# Altium schematic sheet EIS_Flow_Main.SchDoc: 2D-Flow Main
size A4; Organization: Hahn-Schickard; Address1: Wilhelm-Schickard-Str. 10; Address2: 78052 Villingen-Schwenningen; Address3: Bernd.Ehrbrecht@Hahn-Schickard.de; DocumentNumber: 1; Revision: 1.0; SheetNumber: 1; SheetTotal: 2; PhoneNumber: 0 7721 943 137; E-Mail: Xxxx.Xxxx@Hahn-Schickard.de; PageSetup: Record=PageOptions|CenterHorizontal=True|CenterVertical=True|PrintScale=0.97|XCorrection=1.00|YCorrection=1.00|PrintKind=1|BorderSize=5000000|LeftOffset=0|BottomOffset=0|Orientation=2|PaperLength=1000|PaperWidth=1000|Scale=100|PaperSource=15|PrintQuality=600|MediaType=1|DitherType=10|PrintScaleMode=1|PaperKind=A4 (210 x 297 mm)|PaperIndex=9; ProjectName: Project File Name
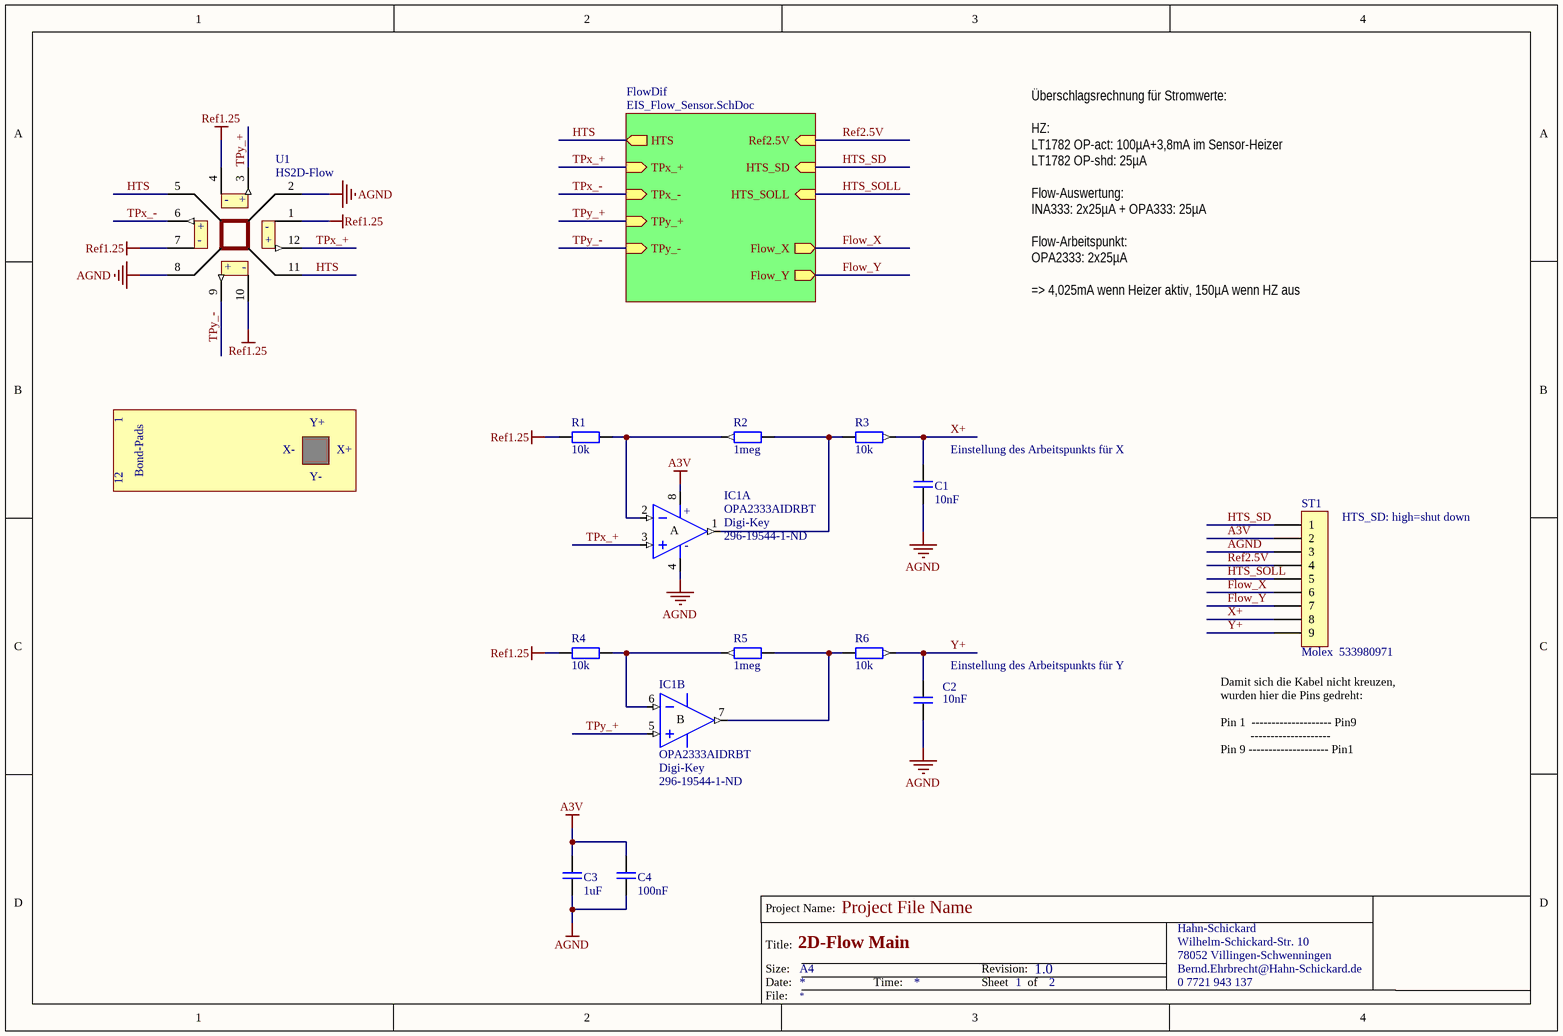
[diagram p0: EIS_Flow_Main.SchDoc]

## Parts
C1  10nF  [CAPC1608N]
C2  10nF  [CAPC1608N]
C3  1uF  [CAPC2012N]
C4  100nF  [CAPC1608N]
IC1  OPA2333AIDRBT  Supplier 1: Digi-Key  Supplier Part Number 1: 296-19544-1-ND  [TI DRB (S-PVON-N8)]  (parts A,B of 2)
R1  10k  [RESC1608N]
R2  1meg  [RESC1608N]
R3  10k  [RESC1608N]
R4  10k  [RESC1608N]
R5  1meg  [RESC1608N]
R6  10k  [RESC1608N]
ST1  Molex  533980971  [Picoblade 9*1,25V]
U1  HS2D-Flow  [Bond_Flow_12p]

## Sub-sheets
FlowDif = EIS_Flow_Sensor.SchDoc: HTS_SD (in), HTS_SOLL (in), Ref2.5V (in), HTS (out), Flow_X (out), TPx_+ (in), TPx_- (in), Flow_Y (out), TPy_+ (in), TPy_- (in)

## Nets
A3V: C3.1 C4.1 IC1.8(V+) ST1.2
AGND: C1.1 C2.2 C3.2 C4.2 IC1.4(V-) ST1.3 U1.2(HZ_nw) U1.8(HZ_so)
Ref1.25: R1.1 R4.1 U1.1(TPn-) U1.4(TPw-) U1.7(TPs-) U1.10(TPo-)
Flow_X: ST1.6 ; sheet FlowDif/Flow_X
Flow_Y: ST1.7 ; sheet FlowDif/Flow_Y
HTS: U1.5(HZ_sw) U1.11(HZ_no) ; sheet FlowDif/HTS
HTS_SD: ST1.1 ; sheet FlowDif/HTS_SD
HTS_SOLL: ST1.5 ; sheet FlowDif/HTS_SOLL
Ref2.5V: ST1.4 ; sheet FlowDif/Ref2.5V
TPx_+: IC1.3(IN1+) U1.12(TPn+) ; sheet FlowDif/TPx_+
TPx_-: U1.6(TPs+) ; sheet FlowDif/TPx_-
TPy_+: IC1.5(IN1+) U1.3(TPw+) ; sheet FlowDif/TPy_+
TPy_-: U1.9(TPo+) ; sheet FlowDif/TPy_-
X+: C1.2 R3.2 ST1.8
Y+: C2.1 R6.2 ST1.9
NetIC1_1: IC1.1(OUT1) R2.2 R3.1
NetIC1_2: IC1.2(IN1-) R1.2 R2.1
NetIC1_6: IC1.6(IN1-) R4.2 R5.1
NetIC1_7: IC1.7(OUT1) R5.2 R6.1

## Notes on the sheet
- Überschlagsrechnung für Stromwerte:
  HZ:
  LT1782 OP-act: 100µA+3,8mA im Sensor-Heizer
  LT1782 OP-shd: 25µA
  Flow-Auswertung:
  INA333: 2x25µA + OPA333: 25µA
  Flow-Arbeitspunkt:
  OPA2333: 2x25µA
  => 4,025mA wenn Heizer aktiv, 150µA wenn HZ aus
- 1
- Y+
- 12
- Bond-Pads
- X-
- Y-
- X+
- (near C1) Einstellung des Arbeitspunkts für X
- (near ST1) HTS_SD: high=shut down
- (near C2) Einstellung des Arbeitspunkts für Y
- (near ST1) Damit sich die Kabel nicht kreuzen, wurden hier die Pins gedreht:
  Pin 1  -------------------- Pin9
  --------------------
  Pin 9 -------------------- Pin1
- Project Name:
- Size:
- Date:
- Title:
- A4
- Time:
- Revision:
- Sheet
- of
- File:
- (in symbol HS2D-Flow) -; +
- (in symbol OPA2333AIDRBT, part A) +; A; -
- (in symbol OPA2333AIDRBT, part B) B

## Library data of the parts
C1-C4 = Kondensator SMD Keramik
IC1 = OPA2333AIDRBT: Dual micro Power OP; 01_Hersteller: Texas Instruments; 05_Datasheet_Link_Lokal: O:\Altium Designer\Datasheets\Texas Instruments\OPA333; 09_Ersteller: HSG Jürgen Merz; 07_Lieferant: Farnell; 08_Lieferanten_Nummer: 1408162; 02_Herstellerbezeichnung: ka; 03_Hersteller_Link: http://www.ti.com; 04_Datasheet_Link: Datasheet; 06 Footprint_Link_Lokal: O:\Altium Designer\Datasheets\Texas Instruments\OPA333; 10_Erstell_Datum: 12.10.2010
R1-R6 = Widerstand SMD
ST1 = MOLEX_Picoblade_9V
U1 = HS2D-Flow: 2d Strömungssensor Hahn-Schickard